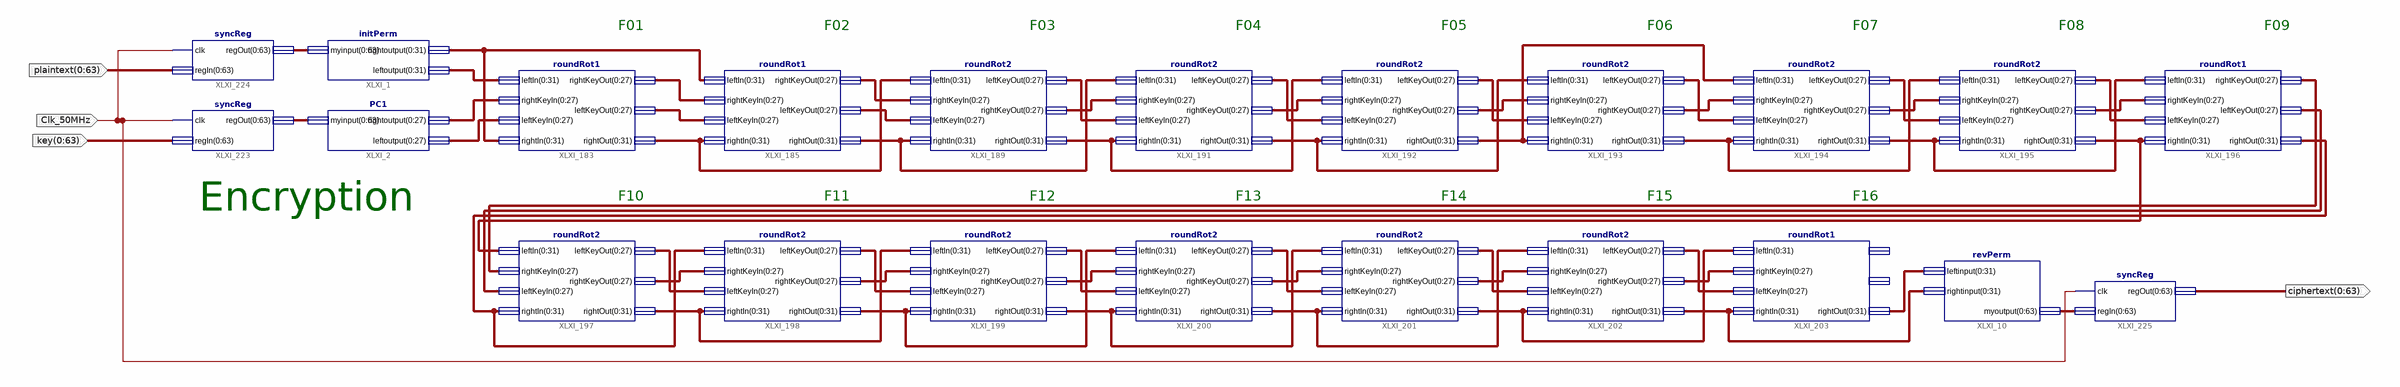
[diagram p0: schematic sheet 1]
// Xilinx ISE schematic schem.sch (spartan3e) as structural Verilog: 22 symbols, 4 ports
module schem (
  input  [0:63] key,
  input  Clk_50MHz,
  input  [0:63] plaintext,
  output [0:63] ciphertext
);

  wire [27:0] C0, D0, XLXN_493, XLXN_494, XLXN_499, XLXN_500, XLXN_502, XLXN_503, XLXN_506, XLXN_507,
       XLXN_509, XLXN_510, XLXN_512, XLXN_513, XLXN_515, XLXN_516, XLXN_518, XLXN_519, XLXN_527, XLXN_529,
       XLXN_532, XLXN_533, XLXN_536, XLXN_537, XLXN_539, XLXN_540, XLXN_542, XLXN_543, XLXN_546, XLXN_547,
       XLXN_549, XLXN_550;
  wire [31:0] XLXN_485, XLXN_496, XLXN_497, XLXN_498, XLXN_501, XLXN_505, XLXN_508, XLXN_511, XLXN_514,
       XLXN_517, XLXN_525, XLXN_531, XLXN_535, XLXN_538, XLXN_541, XLXN_545, XLXN_617, XLXN_618;
  wire [63:0] XLXN_608, XLXN_611, XLXN_616;

  PC1 XLXI_2 (
    .myinput({XLXN_608[0], XLXN_608[1], XLXN_608[2], XLXN_608[3], XLXN_608[4], XLXN_608[5], XLXN_608[6], XLXN_608[7], XLXN_608[8], XLXN_608[9], XLXN_608[10], XLXN_608[11], XLXN_608[12], XLXN_608[13], XLXN_608[14], XLXN_608[15], XLXN_608[16], XLXN_608[17], XLXN_608[18], XLXN_608[19], XLXN_608[20], XLXN_608[21], XLXN_608[22], XLXN_608[23], XLXN_608[24], XLXN_608[25], XLXN_608[26], XLXN_608[27], XLXN_608[28], XLXN_608[29], XLXN_608[30], XLXN_608[31], XLXN_608[32], XLXN_608[33], XLXN_608[34], XLXN_608[35], XLXN_608[36], XLXN_608[37], XLXN_608[38], XLXN_608[39], XLXN_608[40], XLXN_608[41], XLXN_608[42], XLXN_608[43], XLXN_608[44], XLXN_608[45], XLXN_608[46], XLXN_608[47], XLXN_608[48], XLXN_608[49], XLXN_608[50], XLXN_608[51], XLXN_608[52], XLXN_608[53], XLXN_608[54], XLXN_608[55], XLXN_608[56], XLXN_608[57], XLXN_608[58], XLXN_608[59], XLXN_608[60], XLXN_608[61], XLXN_608[62], XLXN_608[63]}),
    .rightoutput({D0[0], D0[1], D0[2], D0[3], D0[4], D0[5], D0[6], D0[7], D0[8], D0[9], D0[10], D0[11], D0[12], D0[13], D0[14], D0[15], D0[16], D0[17], D0[18], D0[19], D0[20], D0[21], D0[22], D0[23], D0[24], D0[25], D0[26], D0[27]}),
    .leftoutput({C0[0], C0[1], C0[2], C0[3], C0[4], C0[5], C0[6], C0[7], C0[8], C0[9], C0[10], C0[11], C0[12], C0[13], C0[14], C0[15], C0[16], C0[17], C0[18], C0[19], C0[20], C0[21], C0[22], C0[23], C0[24], C0[25], C0[26], C0[27]}));
  initPerm XLXI_1 (
    .myinput({XLXN_611[0], XLXN_611[1], XLXN_611[2], XLXN_611[3], XLXN_611[4], XLXN_611[5], XLXN_611[6], XLXN_611[7], XLXN_611[8], XLXN_611[9], XLXN_611[10], XLXN_611[11], XLXN_611[12], XLXN_611[13], XLXN_611[14], XLXN_611[15], XLXN_611[16], XLXN_611[17], XLXN_611[18], XLXN_611[19], XLXN_611[20], XLXN_611[21], XLXN_611[22], XLXN_611[23], XLXN_611[24], XLXN_611[25], XLXN_611[26], XLXN_611[27], XLXN_611[28], XLXN_611[29], XLXN_611[30], XLXN_611[31], XLXN_611[32], XLXN_611[33], XLXN_611[34], XLXN_611[35], XLXN_611[36], XLXN_611[37], XLXN_611[38], XLXN_611[39], XLXN_611[40], XLXN_611[41], XLXN_611[42], XLXN_611[43], XLXN_611[44], XLXN_611[45], XLXN_611[46], XLXN_611[47], XLXN_611[48], XLXN_611[49], XLXN_611[50], XLXN_611[51], XLXN_611[52], XLXN_611[53], XLXN_611[54], XLXN_611[55], XLXN_611[56], XLXN_611[57], XLXN_611[58], XLXN_611[59], XLXN_611[60], XLXN_611[61], XLXN_611[62], XLXN_611[63]}),
    .rightoutput({XLXN_496[0], XLXN_496[1], XLXN_496[2], XLXN_496[3], XLXN_496[4], XLXN_496[5], XLXN_496[6], XLXN_496[7], XLXN_496[8], XLXN_496[9], XLXN_496[10], XLXN_496[11], XLXN_496[12], XLXN_496[13], XLXN_496[14], XLXN_496[15], XLXN_496[16], XLXN_496[17], XLXN_496[18], XLXN_496[19], XLXN_496[20], XLXN_496[21], XLXN_496[22], XLXN_496[23], XLXN_496[24], XLXN_496[25], XLXN_496[26], XLXN_496[27], XLXN_496[28], XLXN_496[29], XLXN_496[30], XLXN_496[31]}),
    .leftoutput({XLXN_485[0], XLXN_485[1], XLXN_485[2], XLXN_485[3], XLXN_485[4], XLXN_485[5], XLXN_485[6], XLXN_485[7], XLXN_485[8], XLXN_485[9], XLXN_485[10], XLXN_485[11], XLXN_485[12], XLXN_485[13], XLXN_485[14], XLXN_485[15], XLXN_485[16], XLXN_485[17], XLXN_485[18], XLXN_485[19], XLXN_485[20], XLXN_485[21], XLXN_485[22], XLXN_485[23], XLXN_485[24], XLXN_485[25], XLXN_485[26], XLXN_485[27], XLXN_485[28], XLXN_485[29], XLXN_485[30], XLXN_485[31]}));
  roundRot1 XLXI_183 (
    .leftIn({XLXN_485[0], XLXN_485[1], XLXN_485[2], XLXN_485[3], XLXN_485[4], XLXN_485[5], XLXN_485[6], XLXN_485[7], XLXN_485[8], XLXN_485[9], XLXN_485[10], XLXN_485[11], XLXN_485[12], XLXN_485[13], XLXN_485[14], XLXN_485[15], XLXN_485[16], XLXN_485[17], XLXN_485[18], XLXN_485[19], XLXN_485[20], XLXN_485[21], XLXN_485[22], XLXN_485[23], XLXN_485[24], XLXN_485[25], XLXN_485[26], XLXN_485[27], XLXN_485[28], XLXN_485[29], XLXN_485[30], XLXN_485[31]}),
    .rightKeyIn({D0[0], D0[1], D0[2], D0[3], D0[4], D0[5], D0[6], D0[7], D0[8], D0[9], D0[10], D0[11], D0[12], D0[13], D0[14], D0[15], D0[16], D0[17], D0[18], D0[19], D0[20], D0[21], D0[22], D0[23], D0[24], D0[25], D0[26], D0[27]}),
    .leftKeyIn({C0[0], C0[1], C0[2], C0[3], C0[4], C0[5], C0[6], C0[7], C0[8], C0[9], C0[10], C0[11], C0[12], C0[13], C0[14], C0[15], C0[16], C0[17], C0[18], C0[19], C0[20], C0[21], C0[22], C0[23], C0[24], C0[25], C0[26], C0[27]}),
    .rightIn({XLXN_496[0], XLXN_496[1], XLXN_496[2], XLXN_496[3], XLXN_496[4], XLXN_496[5], XLXN_496[6], XLXN_496[7], XLXN_496[8], XLXN_496[9], XLXN_496[10], XLXN_496[11], XLXN_496[12], XLXN_496[13], XLXN_496[14], XLXN_496[15], XLXN_496[16], XLXN_496[17], XLXN_496[18], XLXN_496[19], XLXN_496[20], XLXN_496[21], XLXN_496[22], XLXN_496[23], XLXN_496[24], XLXN_496[25], XLXN_496[26], XLXN_496[27], XLXN_496[28], XLXN_496[29], XLXN_496[30], XLXN_496[31]}),
    .rightKeyOut({XLXN_493[0], XLXN_493[1], XLXN_493[2], XLXN_493[3], XLXN_493[4], XLXN_493[5], XLXN_493[6], XLXN_493[7], XLXN_493[8], XLXN_493[9], XLXN_493[10], XLXN_493[11], XLXN_493[12], XLXN_493[13], XLXN_493[14], XLXN_493[15], XLXN_493[16], XLXN_493[17], XLXN_493[18], XLXN_493[19], XLXN_493[20], XLXN_493[21], XLXN_493[22], XLXN_493[23], XLXN_493[24], XLXN_493[25], XLXN_493[26], XLXN_493[27]}),
    .leftKeyOut({XLXN_494[0], XLXN_494[1], XLXN_494[2], XLXN_494[3], XLXN_494[4], XLXN_494[5], XLXN_494[6], XLXN_494[7], XLXN_494[8], XLXN_494[9], XLXN_494[10], XLXN_494[11], XLXN_494[12], XLXN_494[13], XLXN_494[14], XLXN_494[15], XLXN_494[16], XLXN_494[17], XLXN_494[18], XLXN_494[19], XLXN_494[20], XLXN_494[21], XLXN_494[22], XLXN_494[23], XLXN_494[24], XLXN_494[25], XLXN_494[26], XLXN_494[27]}),
    .rightOut({XLXN_497[0], XLXN_497[1], XLXN_497[2], XLXN_497[3], XLXN_497[4], XLXN_497[5], XLXN_497[6], XLXN_497[7], XLXN_497[8], XLXN_497[9], XLXN_497[10], XLXN_497[11], XLXN_497[12], XLXN_497[13], XLXN_497[14], XLXN_497[15], XLXN_497[16], XLXN_497[17], XLXN_497[18], XLXN_497[19], XLXN_497[20], XLXN_497[21], XLXN_497[22], XLXN_497[23], XLXN_497[24], XLXN_497[25], XLXN_497[26], XLXN_497[27], XLXN_497[28], XLXN_497[29], XLXN_497[30], XLXN_497[31]}));
  roundRot1 XLXI_185 (
    .leftIn({XLXN_496[0], XLXN_496[1], XLXN_496[2], XLXN_496[3], XLXN_496[4], XLXN_496[5], XLXN_496[6], XLXN_496[7], XLXN_496[8], XLXN_496[9], XLXN_496[10], XLXN_496[11], XLXN_496[12], XLXN_496[13], XLXN_496[14], XLXN_496[15], XLXN_496[16], XLXN_496[17], XLXN_496[18], XLXN_496[19], XLXN_496[20], XLXN_496[21], XLXN_496[22], XLXN_496[23], XLXN_496[24], XLXN_496[25], XLXN_496[26], XLXN_496[27], XLXN_496[28], XLXN_496[29], XLXN_496[30], XLXN_496[31]}),
    .rightKeyIn({XLXN_493[0], XLXN_493[1], XLXN_493[2], XLXN_493[3], XLXN_493[4], XLXN_493[5], XLXN_493[6], XLXN_493[7], XLXN_493[8], XLXN_493[9], XLXN_493[10], XLXN_493[11], XLXN_493[12], XLXN_493[13], XLXN_493[14], XLXN_493[15], XLXN_493[16], XLXN_493[17], XLXN_493[18], XLXN_493[19], XLXN_493[20], XLXN_493[21], XLXN_493[22], XLXN_493[23], XLXN_493[24], XLXN_493[25], XLXN_493[26], XLXN_493[27]}),
    .leftKeyIn({XLXN_494[0], XLXN_494[1], XLXN_494[2], XLXN_494[3], XLXN_494[4], XLXN_494[5], XLXN_494[6], XLXN_494[7], XLXN_494[8], XLXN_494[9], XLXN_494[10], XLXN_494[11], XLXN_494[12], XLXN_494[13], XLXN_494[14], XLXN_494[15], XLXN_494[16], XLXN_494[17], XLXN_494[18], XLXN_494[19], XLXN_494[20], XLXN_494[21], XLXN_494[22], XLXN_494[23], XLXN_494[24], XLXN_494[25], XLXN_494[26], XLXN_494[27]}),
    .rightIn({XLXN_497[0], XLXN_497[1], XLXN_497[2], XLXN_497[3], XLXN_497[4], XLXN_497[5], XLXN_497[6], XLXN_497[7], XLXN_497[8], XLXN_497[9], XLXN_497[10], XLXN_497[11], XLXN_497[12], XLXN_497[13], XLXN_497[14], XLXN_497[15], XLXN_497[16], XLXN_497[17], XLXN_497[18], XLXN_497[19], XLXN_497[20], XLXN_497[21], XLXN_497[22], XLXN_497[23], XLXN_497[24], XLXN_497[25], XLXN_497[26], XLXN_497[27], XLXN_497[28], XLXN_497[29], XLXN_497[30], XLXN_497[31]}),
    .rightKeyOut({XLXN_500[0], XLXN_500[1], XLXN_500[2], XLXN_500[3], XLXN_500[4], XLXN_500[5], XLXN_500[6], XLXN_500[7], XLXN_500[8], XLXN_500[9], XLXN_500[10], XLXN_500[11], XLXN_500[12], XLXN_500[13], XLXN_500[14], XLXN_500[15], XLXN_500[16], XLXN_500[17], XLXN_500[18], XLXN_500[19], XLXN_500[20], XLXN_500[21], XLXN_500[22], XLXN_500[23], XLXN_500[24], XLXN_500[25], XLXN_500[26], XLXN_500[27]}),
    .leftKeyOut({XLXN_499[0], XLXN_499[1], XLXN_499[2], XLXN_499[3], XLXN_499[4], XLXN_499[5], XLXN_499[6], XLXN_499[7], XLXN_499[8], XLXN_499[9], XLXN_499[10], XLXN_499[11], XLXN_499[12], XLXN_499[13], XLXN_499[14], XLXN_499[15], XLXN_499[16], XLXN_499[17], XLXN_499[18], XLXN_499[19], XLXN_499[20], XLXN_499[21], XLXN_499[22], XLXN_499[23], XLXN_499[24], XLXN_499[25], XLXN_499[26], XLXN_499[27]}),
    .rightOut({XLXN_498[0], XLXN_498[1], XLXN_498[2], XLXN_498[3], XLXN_498[4], XLXN_498[5], XLXN_498[6], XLXN_498[7], XLXN_498[8], XLXN_498[9], XLXN_498[10], XLXN_498[11], XLXN_498[12], XLXN_498[13], XLXN_498[14], XLXN_498[15], XLXN_498[16], XLXN_498[17], XLXN_498[18], XLXN_498[19], XLXN_498[20], XLXN_498[21], XLXN_498[22], XLXN_498[23], XLXN_498[24], XLXN_498[25], XLXN_498[26], XLXN_498[27], XLXN_498[28], XLXN_498[29], XLXN_498[30], XLXN_498[31]}));
  roundRot2 XLXI_189 (
    .leftIn({XLXN_497[0], XLXN_497[1], XLXN_497[2], XLXN_497[3], XLXN_497[4], XLXN_497[5], XLXN_497[6], XLXN_497[7], XLXN_497[8], XLXN_497[9], XLXN_497[10], XLXN_497[11], XLXN_497[12], XLXN_497[13], XLXN_497[14], XLXN_497[15], XLXN_497[16], XLXN_497[17], XLXN_497[18], XLXN_497[19], XLXN_497[20], XLXN_497[21], XLXN_497[22], XLXN_497[23], XLXN_497[24], XLXN_497[25], XLXN_497[26], XLXN_497[27], XLXN_497[28], XLXN_497[29], XLXN_497[30], XLXN_497[31]}),
    .rightKeyIn({XLXN_500[0], XLXN_500[1], XLXN_500[2], XLXN_500[3], XLXN_500[4], XLXN_500[5], XLXN_500[6], XLXN_500[7], XLXN_500[8], XLXN_500[9], XLXN_500[10], XLXN_500[11], XLXN_500[12], XLXN_500[13], XLXN_500[14], XLXN_500[15], XLXN_500[16], XLXN_500[17], XLXN_500[18], XLXN_500[19], XLXN_500[20], XLXN_500[21], XLXN_500[22], XLXN_500[23], XLXN_500[24], XLXN_500[25], XLXN_500[26], XLXN_500[27]}),
    .leftKeyIn({XLXN_499[0], XLXN_499[1], XLXN_499[2], XLXN_499[3], XLXN_499[4], XLXN_499[5], XLXN_499[6], XLXN_499[7], XLXN_499[8], XLXN_499[9], XLXN_499[10], XLXN_499[11], XLXN_499[12], XLXN_499[13], XLXN_499[14], XLXN_499[15], XLXN_499[16], XLXN_499[17], XLXN_499[18], XLXN_499[19], XLXN_499[20], XLXN_499[21], XLXN_499[22], XLXN_499[23], XLXN_499[24], XLXN_499[25], XLXN_499[26], XLXN_499[27]}),
    .rightIn({XLXN_498[0], XLXN_498[1], XLXN_498[2], XLXN_498[3], XLXN_498[4], XLXN_498[5], XLXN_498[6], XLXN_498[7], XLXN_498[8], XLXN_498[9], XLXN_498[10], XLXN_498[11], XLXN_498[12], XLXN_498[13], XLXN_498[14], XLXN_498[15], XLXN_498[16], XLXN_498[17], XLXN_498[18], XLXN_498[19], XLXN_498[20], XLXN_498[21], XLXN_498[22], XLXN_498[23], XLXN_498[24], XLXN_498[25], XLXN_498[26], XLXN_498[27], XLXN_498[28], XLXN_498[29], XLXN_498[30], XLXN_498[31]}),
    .leftKeyOut({XLXN_503[0], XLXN_503[1], XLXN_503[2], XLXN_503[3], XLXN_503[4], XLXN_503[5], XLXN_503[6], XLXN_503[7], XLXN_503[8], XLXN_503[9], XLXN_503[10], XLXN_503[11], XLXN_503[12], XLXN_503[13], XLXN_503[14], XLXN_503[15], XLXN_503[16], XLXN_503[17], XLXN_503[18], XLXN_503[19], XLXN_503[20], XLXN_503[21], XLXN_503[22], XLXN_503[23], XLXN_503[24], XLXN_503[25], XLXN_503[26], XLXN_503[27]}),
    .rightKeyOut({XLXN_502[0], XLXN_502[1], XLXN_502[2], XLXN_502[3], XLXN_502[4], XLXN_502[5], XLXN_502[6], XLXN_502[7], XLXN_502[8], XLXN_502[9], XLXN_502[10], XLXN_502[11], XLXN_502[12], XLXN_502[13], XLXN_502[14], XLXN_502[15], XLXN_502[16], XLXN_502[17], XLXN_502[18], XLXN_502[19], XLXN_502[20], XLXN_502[21], XLXN_502[22], XLXN_502[23], XLXN_502[24], XLXN_502[25], XLXN_502[26], XLXN_502[27]}),
    .rightOut({XLXN_501[0], XLXN_501[1], XLXN_501[2], XLXN_501[3], XLXN_501[4], XLXN_501[5], XLXN_501[6], XLXN_501[7], XLXN_501[8], XLXN_501[9], XLXN_501[10], XLXN_501[11], XLXN_501[12], XLXN_501[13], XLXN_501[14], XLXN_501[15], XLXN_501[16], XLXN_501[17], XLXN_501[18], XLXN_501[19], XLXN_501[20], XLXN_501[21], XLXN_501[22], XLXN_501[23], XLXN_501[24], XLXN_501[25], XLXN_501[26], XLXN_501[27], XLXN_501[28], XLXN_501[29], XLXN_501[30], XLXN_501[31]}));
  roundRot2 XLXI_191 (
    .leftIn({XLXN_498[0], XLXN_498[1], XLXN_498[2], XLXN_498[3], XLXN_498[4], XLXN_498[5], XLXN_498[6], XLXN_498[7], XLXN_498[8], XLXN_498[9], XLXN_498[10], XLXN_498[11], XLXN_498[12], XLXN_498[13], XLXN_498[14], XLXN_498[15], XLXN_498[16], XLXN_498[17], XLXN_498[18], XLXN_498[19], XLXN_498[20], XLXN_498[21], XLXN_498[22], XLXN_498[23], XLXN_498[24], XLXN_498[25], XLXN_498[26], XLXN_498[27], XLXN_498[28], XLXN_498[29], XLXN_498[30], XLXN_498[31]}),
    .rightKeyIn({XLXN_502[0], XLXN_502[1], XLXN_502[2], XLXN_502[3], XLXN_502[4], XLXN_502[5], XLXN_502[6], XLXN_502[7], XLXN_502[8], XLXN_502[9], XLXN_502[10], XLXN_502[11], XLXN_502[12], XLXN_502[13], XLXN_502[14], XLXN_502[15], XLXN_502[16], XLXN_502[17], XLXN_502[18], XLXN_502[19], XLXN_502[20], XLXN_502[21], XLXN_502[22], XLXN_502[23], XLXN_502[24], XLXN_502[25], XLXN_502[26], XLXN_502[27]}),
    .leftKeyIn({XLXN_503[0], XLXN_503[1], XLXN_503[2], XLXN_503[3], XLXN_503[4], XLXN_503[5], XLXN_503[6], XLXN_503[7], XLXN_503[8], XLXN_503[9], XLXN_503[10], XLXN_503[11], XLXN_503[12], XLXN_503[13], XLXN_503[14], XLXN_503[15], XLXN_503[16], XLXN_503[17], XLXN_503[18], XLXN_503[19], XLXN_503[20], XLXN_503[21], XLXN_503[22], XLXN_503[23], XLXN_503[24], XLXN_503[25], XLXN_503[26], XLXN_503[27]}),
    .rightIn({XLXN_501[0], XLXN_501[1], XLXN_501[2], XLXN_501[3], XLXN_501[4], XLXN_501[5], XLXN_501[6], XLXN_501[7], XLXN_501[8], XLXN_501[9], XLXN_501[10], XLXN_501[11], XLXN_501[12], XLXN_501[13], XLXN_501[14], XLXN_501[15], XLXN_501[16], XLXN_501[17], XLXN_501[18], XLXN_501[19], XLXN_501[20], XLXN_501[21], XLXN_501[22], XLXN_501[23], XLXN_501[24], XLXN_501[25], XLXN_501[26], XLXN_501[27], XLXN_501[28], XLXN_501[29], XLXN_501[30], XLXN_501[31]}),
    .leftKeyOut({XLXN_507[0], XLXN_507[1], XLXN_507[2], XLXN_507[3], XLXN_507[4], XLXN_507[5], XLXN_507[6], XLXN_507[7], XLXN_507[8], XLXN_507[9], XLXN_507[10], XLXN_507[11], XLXN_507[12], XLXN_507[13], XLXN_507[14], XLXN_507[15], XLXN_507[16], XLXN_507[17], XLXN_507[18], XLXN_507[19], XLXN_507[20], XLXN_507[21], XLXN_507[22], XLXN_507[23], XLXN_507[24], XLXN_507[25], XLXN_507[26], XLXN_507[27]}),
    .rightKeyOut({XLXN_506[0], XLXN_506[1], XLXN_506[2], XLXN_506[3], XLXN_506[4], XLXN_506[5], XLXN_506[6], XLXN_506[7], XLXN_506[8], XLXN_506[9], XLXN_506[10], XLXN_506[11], XLXN_506[12], XLXN_506[13], XLXN_506[14], XLXN_506[15], XLXN_506[16], XLXN_506[17], XLXN_506[18], XLXN_506[19], XLXN_506[20], XLXN_506[21], XLXN_506[22], XLXN_506[23], XLXN_506[24], XLXN_506[25], XLXN_506[26], XLXN_506[27]}),
    .rightOut({XLXN_505[0], XLXN_505[1], XLXN_505[2], XLXN_505[3], XLXN_505[4], XLXN_505[5], XLXN_505[6], XLXN_505[7], XLXN_505[8], XLXN_505[9], XLXN_505[10], XLXN_505[11], XLXN_505[12], XLXN_505[13], XLXN_505[14], XLXN_505[15], XLXN_505[16], XLXN_505[17], XLXN_505[18], XLXN_505[19], XLXN_505[20], XLXN_505[21], XLXN_505[22], XLXN_505[23], XLXN_505[24], XLXN_505[25], XLXN_505[26], XLXN_505[27], XLXN_505[28], XLXN_505[29], XLXN_505[30], XLXN_505[31]}));
  roundRot2 XLXI_192 (
    .leftIn({XLXN_501[0], XLXN_501[1], XLXN_501[2], XLXN_501[3], XLXN_501[4], XLXN_501[5], XLXN_501[6], XLXN_501[7], XLXN_501[8], XLXN_501[9], XLXN_501[10], XLXN_501[11], XLXN_501[12], XLXN_501[13], XLXN_501[14], XLXN_501[15], XLXN_501[16], XLXN_501[17], XLXN_501[18], XLXN_501[19], XLXN_501[20], XLXN_501[21], XLXN_501[22], XLXN_501[23], XLXN_501[24], XLXN_501[25], XLXN_501[26], XLXN_501[27], XLXN_501[28], XLXN_501[29], XLXN_501[30], XLXN_501[31]}),
    .rightKeyIn({XLXN_506[0], XLXN_506[1], XLXN_506[2], XLXN_506[3], XLXN_506[4], XLXN_506[5], XLXN_506[6], XLXN_506[7], XLXN_506[8], XLXN_506[9], XLXN_506[10], XLXN_506[11], XLXN_506[12], XLXN_506[13], XLXN_506[14], XLXN_506[15], XLXN_506[16], XLXN_506[17], XLXN_506[18], XLXN_506[19], XLXN_506[20], XLXN_506[21], XLXN_506[22], XLXN_506[23], XLXN_506[24], XLXN_506[25], XLXN_506[26], XLXN_506[27]}),
    .leftKeyIn({XLXN_507[0], XLXN_507[1], XLXN_507[2], XLXN_507[3], XLXN_507[4], XLXN_507[5], XLXN_507[6], XLXN_507[7], XLXN_507[8], XLXN_507[9], XLXN_507[10], XLXN_507[11], XLXN_507[12], XLXN_507[13], XLXN_507[14], XLXN_507[15], XLXN_507[16], XLXN_507[17], XLXN_507[18], XLXN_507[19], XLXN_507[20], XLXN_507[21], XLXN_507[22], XLXN_507[23], XLXN_507[24], XLXN_507[25], XLXN_507[26], XLXN_507[27]}),
    .rightIn({XLXN_505[0], XLXN_505[1], XLXN_505[2], XLXN_505[3], XLXN_505[4], XLXN_505[5], XLXN_505[6], XLXN_505[7], XLXN_505[8], XLXN_505[9], XLXN_505[10], XLXN_505[11], XLXN_505[12], XLXN_505[13], XLXN_505[14], XLXN_505[15], XLXN_505[16], XLXN_505[17], XLXN_505[18], XLXN_505[19], XLXN_505[20], XLXN_505[21], XLXN_505[22], XLXN_505[23], XLXN_505[24], XLXN_505[25], XLXN_505[26], XLXN_505[27], XLXN_505[28], XLXN_505[29], XLXN_505[30], XLXN_505[31]}),
    .leftKeyOut({XLXN_510[0], XLXN_510[1], XLXN_510[2], XLXN_510[3], XLXN_510[4], XLXN_510[5], XLXN_510[6], XLXN_510[7], XLXN_510[8], XLXN_510[9], XLXN_510[10], XLXN_510[11], XLXN_510[12], XLXN_510[13], XLXN_510[14], XLXN_510[15], XLXN_510[16], XLXN_510[17], XLXN_510[18], XLXN_510[19], XLXN_510[20], XLXN_510[21], XLXN_510[22], XLXN_510[23], XLXN_510[24], XLXN_510[25], XLXN_510[26], XLXN_510[27]}),
    .rightKeyOut({XLXN_509[0], XLXN_509[1], XLXN_509[2], XLXN_509[3], XLXN_509[4], XLXN_509[5], XLXN_509[6], XLXN_509[7], XLXN_509[8], XLXN_509[9], XLXN_509[10], XLXN_509[11], XLXN_509[12], XLXN_509[13], XLXN_509[14], XLXN_509[15], XLXN_509[16], XLXN_509[17], XLXN_509[18], XLXN_509[19], XLXN_509[20], XLXN_509[21], XLXN_509[22], XLXN_509[23], XLXN_509[24], XLXN_509[25], XLXN_509[26], XLXN_509[27]}),
    .rightOut({XLXN_508[0], XLXN_508[1], XLXN_508[2], XLXN_508[3], XLXN_508[4], XLXN_508[5], XLXN_508[6], XLXN_508[7], XLXN_508[8], XLXN_508[9], XLXN_508[10], XLXN_508[11], XLXN_508[12], XLXN_508[13], XLXN_508[14], XLXN_508[15], XLXN_508[16], XLXN_508[17], XLXN_508[18], XLXN_508[19], XLXN_508[20], XLXN_508[21], XLXN_508[22], XLXN_508[23], XLXN_508[24], XLXN_508[25], XLXN_508[26], XLXN_508[27], XLXN_508[28], XLXN_508[29], XLXN_508[30], XLXN_508[31]}));
  roundRot2 XLXI_193 (
    .leftIn({XLXN_505[0], XLXN_505[1], XLXN_505[2], XLXN_505[3], XLXN_505[4], XLXN_505[5], XLXN_505[6], XLXN_505[7], XLXN_505[8], XLXN_505[9], XLXN_505[10], XLXN_505[11], XLXN_505[12], XLXN_505[13], XLXN_505[14], XLXN_505[15], XLXN_505[16], XLXN_505[17], XLXN_505[18], XLXN_505[19], XLXN_505[20], XLXN_505[21], XLXN_505[22], XLXN_505[23], XLXN_505[24], XLXN_505[25], XLXN_505[26], XLXN_505[27], XLXN_505[28], XLXN_505[29], XLXN_505[30], XLXN_505[31]}),
    .rightKeyIn({XLXN_509[0], XLXN_509[1], XLXN_509[2], XLXN_509[3], XLXN_509[4], XLXN_509[5], XLXN_509[6], XLXN_509[7], XLXN_509[8], XLXN_509[9], XLXN_509[10], XLXN_509[11], XLXN_509[12], XLXN_509[13], XLXN_509[14], XLXN_509[15], XLXN_509[16], XLXN_509[17], XLXN_509[18], XLXN_509[19], XLXN_509[20], XLXN_509[21], XLXN_509[22], XLXN_509[23], XLXN_509[24], XLXN_509[25], XLXN_509[26], XLXN_509[27]}),
    .leftKeyIn({XLXN_510[0], XLXN_510[1], XLXN_510[2], XLXN_510[3], XLXN_510[4], XLXN_510[5], XLXN_510[6], XLXN_510[7], XLXN_510[8], XLXN_510[9], XLXN_510[10], XLXN_510[11], XLXN_510[12], XLXN_510[13], XLXN_510[14], XLXN_510[15], XLXN_510[16], XLXN_510[17], XLXN_510[18], XLXN_510[19], XLXN_510[20], XLXN_510[21], XLXN_510[22], XLXN_510[23], XLXN_510[24], XLXN_510[25], XLXN_510[26], XLXN_510[27]}),
    .rightIn({XLXN_508[0], XLXN_508[1], XLXN_508[2], XLXN_508[3], XLXN_508[4], XLXN_508[5], XLXN_508[6], XLXN_508[7], XLXN_508[8], XLXN_508[9], XLXN_508[10], XLXN_508[11], XLXN_508[12], XLXN_508[13], XLXN_508[14], XLXN_508[15], XLXN_508[16], XLXN_508[17], XLXN_508[18], XLXN_508[19], XLXN_508[20], XLXN_508[21], XLXN_508[22], XLXN_508[23], XLXN_508[24], XLXN_508[25], XLXN_508[26], XLXN_508[27], XLXN_508[28], XLXN_508[29], XLXN_508[30], XLXN_508[31]}),
    .leftKeyOut({XLXN_513[0], XLXN_513[1], XLXN_513[2], XLXN_513[3], XLXN_513[4], XLXN_513[5], XLXN_513[6], XLXN_513[7], XLXN_513[8], XLXN_513[9], XLXN_513[10], XLXN_513[11], XLXN_513[12], XLXN_513[13], XLXN_513[14], XLXN_513[15], XLXN_513[16], XLXN_513[17], XLXN_513[18], XLXN_513[19], XLXN_513[20], XLXN_513[21], XLXN_513[22], XLXN_513[23], XLXN_513[24], XLXN_513[25], XLXN_513[26], XLXN_513[27]}),
    .rightKeyOut({XLXN_512[0], XLXN_512[1], XLXN_512[2], XLXN_512[3], XLXN_512[4], XLXN_512[5], XLXN_512[6], XLXN_512[7], XLXN_512[8], XLXN_512[9], XLXN_512[10], XLXN_512[11], XLXN_512[12], XLXN_512[13], XLXN_512[14], XLXN_512[15], XLXN_512[16], XLXN_512[17], XLXN_512[18], XLXN_512[19], XLXN_512[20], XLXN_512[21], XLXN_512[22], XLXN_512[23], XLXN_512[24], XLXN_512[25], XLXN_512[26], XLXN_512[27]}),
    .rightOut({XLXN_511[0], XLXN_511[1], XLXN_511[2], XLXN_511[3], XLXN_511[4], XLXN_511[5], XLXN_511[6], XLXN_511[7], XLXN_511[8], XLXN_511[9], XLXN_511[10], XLXN_511[11], XLXN_511[12], XLXN_511[13], XLXN_511[14], XLXN_511[15], XLXN_511[16], XLXN_511[17], XLXN_511[18], XLXN_511[19], XLXN_511[20], XLXN_511[21], XLXN_511[22], XLXN_511[23], XLXN_511[24], XLXN_511[25], XLXN_511[26], XLXN_511[27], XLXN_511[28], XLXN_511[29], XLXN_511[30], XLXN_511[31]}));
  roundRot2 XLXI_194 (
    .leftIn({XLXN_508[0], XLXN_508[1], XLXN_508[2], XLXN_508[3], XLXN_508[4], XLXN_508[5], XLXN_508[6], XLXN_508[7], XLXN_508[8], XLXN_508[9], XLXN_508[10], XLXN_508[11], XLXN_508[12], XLXN_508[13], XLXN_508[14], XLXN_508[15], XLXN_508[16], XLXN_508[17], XLXN_508[18], XLXN_508[19], XLXN_508[20], XLXN_508[21], XLXN_508[22], XLXN_508[23], XLXN_508[24], XLXN_508[25], XLXN_508[26], XLXN_508[27], XLXN_508[28], XLXN_508[29], XLXN_508[30], XLXN_508[31]}),
    .rightKeyIn({XLXN_512[0], XLXN_512[1], XLXN_512[2], XLXN_512[3], XLXN_512[4], XLXN_512[5], XLXN_512[6], XLXN_512[7], XLXN_512[8], XLXN_512[9], XLXN_512[10], XLXN_512[11], XLXN_512[12], XLXN_512[13], XLXN_512[14], XLXN_512[15], XLXN_512[16], XLXN_512[17], XLXN_512[18], XLXN_512[19], XLXN_512[20], XLXN_512[21], XLXN_512[22], XLXN_512[23], XLXN_512[24], XLXN_512[25], XLXN_512[26], XLXN_512[27]}),
    .leftKeyIn({XLXN_513[0], XLXN_513[1], XLXN_513[2], XLXN_513[3], XLXN_513[4], XLXN_513[5], XLXN_513[6], XLXN_513[7], XLXN_513[8], XLXN_513[9], XLXN_513[10], XLXN_513[11], XLXN_513[12], XLXN_513[13], XLXN_513[14], XLXN_513[15], XLXN_513[16], XLXN_513[17], XLXN_513[18], XLXN_513[19], XLXN_513[20], XLXN_513[21], XLXN_513[22], XLXN_513[23], XLXN_513[24], XLXN_513[25], XLXN_513[26], XLXN_513[27]}),
    .rightIn({XLXN_511[0], XLXN_511[1], XLXN_511[2], XLXN_511[3], XLXN_511[4], XLXN_511[5], XLXN_511[6], XLXN_511[7], XLXN_511[8], XLXN_511[9], XLXN_511[10], XLXN_511[11], XLXN_511[12], XLXN_511[13], XLXN_511[14], XLXN_511[15], XLXN_511[16], XLXN_511[17], XLXN_511[18], XLXN_511[19], XLXN_511[20], XLXN_511[21], XLXN_511[22], XLXN_511[23], XLXN_511[24], XLXN_511[25], XLXN_511[26], XLXN_511[27], XLXN_511[28], XLXN_511[29], XLXN_511[30], XLXN_511[31]}),
    .leftKeyOut({XLXN_516[0], XLXN_516[1], XLXN_516[2], XLXN_516[3], XLXN_516[4], XLXN_516[5], XLXN_516[6], XLXN_516[7], XLXN_516[8], XLXN_516[9], XLXN_516[10], XLXN_516[11], XLXN_516[12], XLXN_516[13], XLXN_516[14], XLXN_516[15], XLXN_516[16], XLXN_516[17], XLXN_516[18], XLXN_516[19], XLXN_516[20], XLXN_516[21], XLXN_516[22], XLXN_516[23], XLXN_516[24], XLXN_516[25], XLXN_516[26], XLXN_516[27]}),
    .rightKeyOut({XLXN_515[0], XLXN_515[1], XLXN_515[2], XLXN_515[3], XLXN_515[4], XLXN_515[5], XLXN_515[6], XLXN_515[7], XLXN_515[8], XLXN_515[9], XLXN_515[10], XLXN_515[11], XLXN_515[12], XLXN_515[13], XLXN_515[14], XLXN_515[15], XLXN_515[16], XLXN_515[17], XLXN_515[18], XLXN_515[19], XLXN_515[20], XLXN_515[21], XLXN_515[22], XLXN_515[23], XLXN_515[24], XLXN_515[25], XLXN_515[26], XLXN_515[27]}),
    .rightOut({XLXN_514[0], XLXN_514[1], XLXN_514[2], XLXN_514[3], XLXN_514[4], XLXN_514[5], XLXN_514[6], XLXN_514[7], XLXN_514[8], XLXN_514[9], XLXN_514[10], XLXN_514[11], XLXN_514[12], XLXN_514[13], XLXN_514[14], XLXN_514[15], XLXN_514[16], XLXN_514[17], XLXN_514[18], XLXN_514[19], XLXN_514[20], XLXN_514[21], XLXN_514[22], XLXN_514[23], XLXN_514[24], XLXN_514[25], XLXN_514[26], XLXN_514[27], XLXN_514[28], XLXN_514[29], XLXN_514[30], XLXN_514[31]}));
  roundRot2 XLXI_195 (
    .leftIn({XLXN_511[0], XLXN_511[1], XLXN_511[2], XLXN_511[3], XLXN_511[4], XLXN_511[5], XLXN_511[6], XLXN_511[7], XLXN_511[8], XLXN_511[9], XLXN_511[10], XLXN_511[11], XLXN_511[12], XLXN_511[13], XLXN_511[14], XLXN_511[15], XLXN_511[16], XLXN_511[17], XLXN_511[18], XLXN_511[19], XLXN_511[20], XLXN_511[21], XLXN_511[22], XLXN_511[23], XLXN_511[24], XLXN_511[25], XLXN_511[26], XLXN_511[27], XLXN_511[28], XLXN_511[29], XLXN_511[30], XLXN_511[31]}),
    .rightKeyIn({XLXN_515[0], XLXN_515[1], XLXN_515[2], XLXN_515[3], XLXN_515[4], XLXN_515[5], XLXN_515[6], XLXN_515[7], XLXN_515[8], XLXN_515[9], XLXN_515[10], XLXN_515[11], XLXN_515[12], XLXN_515[13], XLXN_515[14], XLXN_515[15], XLXN_515[16], XLXN_515[17], XLXN_515[18], XLXN_515[19], XLXN_515[20], XLXN_515[21], XLXN_515[22], XLXN_515[23], XLXN_515[24], XLXN_515[25], XLXN_515[26], XLXN_515[27]}),
    .leftKeyIn({XLXN_516[0], XLXN_516[1], XLXN_516[2], XLXN_516[3], XLXN_516[4], XLXN_516[5], XLXN_516[6], XLXN_516[7], XLXN_516[8], XLXN_516[9], XLXN_516[10], XLXN_516[11], XLXN_516[12], XLXN_516[13], XLXN_516[14], XLXN_516[15], XLXN_516[16], XLXN_516[17], XLXN_516[18], XLXN_516[19], XLXN_516[20], XLXN_516[21], XLXN_516[22], XLXN_516[23], XLXN_516[24], XLXN_516[25], XLXN_516[26], XLXN_516[27]}),
    .rightIn({XLXN_514[0], XLXN_514[1], XLXN_514[2], XLXN_514[3], XLXN_514[4], XLXN_514[5], XLXN_514[6], XLXN_514[7], XLXN_514[8], XLXN_514[9], XLXN_514[10], XLXN_514[11], XLXN_514[12], XLXN_514[13], XLXN_514[14], XLXN_514[15], XLXN_514[16], XLXN_514[17], XLXN_514[18], XLXN_514[19], XLXN_514[20], XLXN_514[21], XLXN_514[22], XLXN_514[23], XLXN_514[24], XLXN_514[25], XLXN_514[26], XLXN_514[27], XLXN_514[28], XLXN_514[29], XLXN_514[30], XLXN_514[31]}),
    .leftKeyOut({XLXN_519[0], XLXN_519[1], XLXN_519[2], XLXN_519[3], XLXN_519[4], XLXN_519[5], XLXN_519[6], XLXN_519[7], XLXN_519[8], XLXN_519[9], XLXN_519[10], XLXN_519[11], XLXN_519[12], XLXN_519[13], XLXN_519[14], XLXN_519[15], XLXN_519[16], XLXN_519[17], XLXN_519[18], XLXN_519[19], XLXN_519[20], XLXN_519[21], XLXN_519[22], XLXN_519[23], XLXN_519[24], XLXN_519[25], XLXN_519[26], XLXN_519[27]}),
    .rightKeyOut({XLXN_518[0], XLXN_518[1], XLXN_518[2], XLXN_518[3], XLXN_518[4], XLXN_518[5], XLXN_518[6], XLXN_518[7], XLXN_518[8], XLXN_518[9], XLXN_518[10], XLXN_518[11], XLXN_518[12], XLXN_518[13], XLXN_518[14], XLXN_518[15], XLXN_518[16], XLXN_518[17], XLXN_518[18], XLXN_518[19], XLXN_518[20], XLXN_518[21], XLXN_518[22], XLXN_518[23], XLXN_518[24], XLXN_518[25], XLXN_518[26], XLXN_518[27]}),
    .rightOut({XLXN_517[0], XLXN_517[1], XLXN_517[2], XLXN_517[3], XLXN_517[4], XLXN_517[5], XLXN_517[6], XLXN_517[7], XLXN_517[8], XLXN_517[9], XLXN_517[10], XLXN_517[11], XLXN_517[12], XLXN_517[13], XLXN_517[14], XLXN_517[15], XLXN_517[16], XLXN_517[17], XLXN_517[18], XLXN_517[19], XLXN_517[20], XLXN_517[21], XLXN_517[22], XLXN_517[23], XLXN_517[24], XLXN_517[25], XLXN_517[26], XLXN_517[27], XLXN_517[28], XLXN_517[29], XLXN_517[30], XLXN_517[31]}));
  roundRot1 XLXI_196 (
    .leftIn({XLXN_514[0], XLXN_514[1], XLXN_514[2], XLXN_514[3], XLXN_514[4], XLXN_514[5], XLXN_514[6], XLXN_514[7], XLXN_514[8], XLXN_514[9], XLXN_514[10], XLXN_514[11], XLXN_514[12], XLXN_514[13], XLXN_514[14], XLXN_514[15], XLXN_514[16], XLXN_514[17], XLXN_514[18], XLXN_514[19], XLXN_514[20], XLXN_514[21], XLXN_514[22], XLXN_514[23], XLXN_514[24], XLXN_514[25], XLXN_514[26], XLXN_514[27], XLXN_514[28], XLXN_514[29], XLXN_514[30], XLXN_514[31]}),
    .rightKeyIn({XLXN_518[0], XLXN_518[1], XLXN_518[2], XLXN_518[3], XLXN_518[4], XLXN_518[5], XLXN_518[6], XLXN_518[7], XLXN_518[8], XLXN_518[9], XLXN_518[10], XLXN_518[11], XLXN_518[12], XLXN_518[13], XLXN_518[14], XLXN_518[15], XLXN_518[16], XLXN_518[17], XLXN_518[18], XLXN_518[19], XLXN_518[20], XLXN_518[21], XLXN_518[22], XLXN_518[23], XLXN_518[24], XLXN_518[25], XLXN_518[26], XLXN_518[27]}),
    .leftKeyIn({XLXN_519[0], XLXN_519[1], XLXN_519[2], XLXN_519[3], XLXN_519[4], XLXN_519[5], XLXN_519[6], XLXN_519[7], XLXN_519[8], XLXN_519[9], XLXN_519[10], XLXN_519[11], XLXN_519[12], XLXN_519[13], XLXN_519[14], XLXN_519[15], XLXN_519[16], XLXN_519[17], XLXN_519[18], XLXN_519[19], XLXN_519[20], XLXN_519[21], XLXN_519[22], XLXN_519[23], XLXN_519[24], XLXN_519[25], XLXN_519[26], XLXN_519[27]}),
    .rightIn({XLXN_517[0], XLXN_517[1], XLXN_517[2], XLXN_517[3], XLXN_517[4], XLXN_517[5], XLXN_517[6], XLXN_517[7], XLXN_517[8], XLXN_517[9], XLXN_517[10], XLXN_517[11], XLXN_517[12], XLXN_517[13], XLXN_517[14], XLXN_517[15], XLXN_517[16], XLXN_517[17], XLXN_517[18], XLXN_517[19], XLXN_517[20], XLXN_517[21], XLXN_517[22], XLXN_517[23], XLXN_517[24], XLXN_517[25], XLXN_517[26], XLXN_517[27], XLXN_517[28], XLXN_517[29], XLXN_517[30], XLXN_517[31]}),
    .rightKeyOut({XLXN_529[0], XLXN_529[1], XLXN_529[2], XLXN_529[3], XLXN_529[4], XLXN_529[5], XLXN_529[6], XLXN_529[7], XLXN_529[8], XLXN_529[9], XLXN_529[10], XLXN_529[11], XLXN_529[12], XLXN_529[13], XLXN_529[14], XLXN_529[15], XLXN_529[16], XLXN_529[17], XLXN_529[18], XLXN_529[19], XLXN_529[20], XLXN_529[21], XLXN_529[22], XLXN_529[23], XLXN_529[24], XLXN_529[25], XLXN_529[26], XLXN_529[27]}),
    .leftKeyOut({XLXN_527[0], XLXN_527[1], XLXN_527[2], XLXN_527[3], XLXN_527[4], XLXN_527[5], XLXN_527[6], XLXN_527[7], XLXN_527[8], XLXN_527[9], XLXN_527[10], XLXN_527[11], XLXN_527[12], XLXN_527[13], XLXN_527[14], XLXN_527[15], XLXN_527[16], XLXN_527[17], XLXN_527[18], XLXN_527[19], XLXN_527[20], XLXN_527[21], XLXN_527[22], XLXN_527[23], XLXN_527[24], XLXN_527[25], XLXN_527[26], XLXN_527[27]}),
    .rightOut({XLXN_525[0], XLXN_525[1], XLXN_525[2], XLXN_525[3], XLXN_525[4], XLXN_525[5], XLXN_525[6], XLXN_525[7], XLXN_525[8], XLXN_525[9], XLXN_525[10], XLXN_525[11], XLXN_525[12], XLXN_525[13], XLXN_525[14], XLXN_525[15], XLXN_525[16], XLXN_525[17], XLXN_525[18], XLXN_525[19], XLXN_525[20], XLXN_525[21], XLXN_525[22], XLXN_525[23], XLXN_525[24], XLXN_525[25], XLXN_525[26], XLXN_525[27], XLXN_525[28], XLXN_525[29], XLXN_525[30], XLXN_525[31]}));
  roundRot2 XLXI_197 (
    .leftIn({XLXN_517[0], XLXN_517[1], XLXN_517[2], XLXN_517[3], XLXN_517[4], XLXN_517[5], XLXN_517[6], XLXN_517[7], XLXN_517[8], XLXN_517[9], XLXN_517[10], XLXN_517[11], XLXN_517[12], XLXN_517[13], XLXN_517[14], XLXN_517[15], XLXN_517[16], XLXN_517[17], XLXN_517[18], XLXN_517[19], XLXN_517[20], XLXN_517[21], XLXN_517[22], XLXN_517[23], XLXN_517[24], XLXN_517[25], XLXN_517[26], XLXN_517[27], XLXN_517[28], XLXN_517[29], XLXN_517[30], XLXN_517[31]}),
    .rightKeyIn({XLXN_529[0], XLXN_529[1], XLXN_529[2], XLXN_529[3], XLXN_529[4], XLXN_529[5], XLXN_529[6], XLXN_529[7], XLXN_529[8], XLXN_529[9], XLXN_529[10], XLXN_529[11], XLXN_529[12], XLXN_529[13], XLXN_529[14], XLXN_529[15], XLXN_529[16], XLXN_529[17], XLXN_529[18], XLXN_529[19], XLXN_529[20], XLXN_529[21], XLXN_529[22], XLXN_529[23], XLXN_529[24], XLXN_529[25], XLXN_529[26], XLXN_529[27]}),
    .leftKeyIn({XLXN_527[0], XLXN_527[1], XLXN_527[2], XLXN_527[3], XLXN_527[4], XLXN_527[5], XLXN_527[6], XLXN_527[7], XLXN_527[8], XLXN_527[9], XLXN_527[10], XLXN_527[11], XLXN_527[12], XLXN_527[13], XLXN_527[14], XLXN_527[15], XLXN_527[16], XLXN_527[17], XLXN_527[18], XLXN_527[19], XLXN_527[20], XLXN_527[21], XLXN_527[22], XLXN_527[23], XLXN_527[24], XLXN_527[25], XLXN_527[26], XLXN_527[27]}),
    .rightIn({XLXN_525[0], XLXN_525[1], XLXN_525[2], XLXN_525[3], XLXN_525[4], XLXN_525[5], XLXN_525[6], XLXN_525[7], XLXN_525[8], XLXN_525[9], XLXN_525[10], XLXN_525[11], XLXN_525[12], XLXN_525[13], XLXN_525[14], XLXN_525[15], XLXN_525[16], XLXN_525[17], XLXN_525[18], XLXN_525[19], XLXN_525[20], XLXN_525[21], XLXN_525[22], XLXN_525[23], XLXN_525[24], XLXN_525[25], XLXN_525[26], XLXN_525[27], XLXN_525[28], XLXN_525[29], XLXN_525[30], XLXN_525[31]}),
    .leftKeyOut({XLXN_533[0], XLXN_533[1], XLXN_533[2], XLXN_533[3], XLXN_533[4], XLXN_533[5], XLXN_533[6], XLXN_533[7], XLXN_533[8], XLXN_533[9], XLXN_533[10], XLXN_533[11], XLXN_533[12], XLXN_533[13], XLXN_533[14], XLXN_533[15], XLXN_533[16], XLXN_533[17], XLXN_533[18], XLXN_533[19], XLXN_533[20], XLXN_533[21], XLXN_533[22], XLXN_533[23], XLXN_533[24], XLXN_533[25], XLXN_533[26], XLXN_533[27]}),
    .rightKeyOut({XLXN_532[0], XLXN_532[1], XLXN_532[2], XLXN_532[3], XLXN_532[4], XLXN_532[5], XLXN_532[6], XLXN_532[7], XLXN_532[8], XLXN_532[9], XLXN_532[10], XLXN_532[11], XLXN_532[12], XLXN_532[13], XLXN_532[14], XLXN_532[15], XLXN_532[16], XLXN_532[17], XLXN_532[18], XLXN_532[19], XLXN_532[20], XLXN_532[21], XLXN_532[22], XLXN_532[23], XLXN_532[24], XLXN_532[25], XLXN_532[26], XLXN_532[27]}),
    .rightOut({XLXN_531[0], XLXN_531[1], XLXN_531[2], XLXN_531[3], XLXN_531[4], XLXN_531[5], XLXN_531[6], XLXN_531[7], XLXN_531[8], XLXN_531[9], XLXN_531[10], XLXN_531[11], XLXN_531[12], XLXN_531[13], XLXN_531[14], XLXN_531[15], XLXN_531[16], XLXN_531[17], XLXN_531[18], XLXN_531[19], XLXN_531[20], XLXN_531[21], XLXN_531[22], XLXN_531[23], XLXN_531[24], XLXN_531[25], XLXN_531[26], XLXN_531[27], XLXN_531[28], XLXN_531[29], XLXN_531[30], XLXN_531[31]}));
  roundRot2 XLXI_198 (
    .leftIn({XLXN_525[0], XLXN_525[1], XLXN_525[2], XLXN_525[3], XLXN_525[4], XLXN_525[5], XLXN_525[6], XLXN_525[7], XLXN_525[8], XLXN_525[9], XLXN_525[10], XLXN_525[11], XLXN_525[12], XLXN_525[13], XLXN_525[14], XLXN_525[15], XLXN_525[16], XLXN_525[17], XLXN_525[18], XLXN_525[19], XLXN_525[20], XLXN_525[21], XLXN_525[22], XLXN_525[23], XLXN_525[24], XLXN_525[25], XLXN_525[26], XLXN_525[27], XLXN_525[28], XLXN_525[29], XLXN_525[30], XLXN_525[31]}),
    .rightKeyIn({XLXN_532[0], XLXN_532[1], XLXN_532[2], XLXN_532[3], XLXN_532[4], XLXN_532[5], XLXN_532[6], XLXN_532[7], XLXN_532[8], XLXN_532[9], XLXN_532[10], XLXN_532[11], XLXN_532[12], XLXN_532[13], XLXN_532[14], XLXN_532[15], XLXN_532[16], XLXN_532[17], XLXN_532[18], XLXN_532[19], XLXN_532[20], XLXN_532[21], XLXN_532[22], XLXN_532[23], XLXN_532[24], XLXN_532[25], XLXN_532[26], XLXN_532[27]}),
    .leftKeyIn({XLXN_533[0], XLXN_533[1], XLXN_533[2], XLXN_533[3], XLXN_533[4], XLXN_533[5], XLXN_533[6], XLXN_533[7], XLXN_533[8], XLXN_533[9], XLXN_533[10], XLXN_533[11], XLXN_533[12], XLXN_533[13], XLXN_533[14], XLXN_533[15], XLXN_533[16], XLXN_533[17], XLXN_533[18], XLXN_533[19], XLXN_533[20], XLXN_533[21], XLXN_533[22], XLXN_533[23], XLXN_533[24], XLXN_533[25], XLXN_533[26], XLXN_533[27]}),
    .rightIn({XLXN_531[0], XLXN_531[1], XLXN_531[2], XLXN_531[3], XLXN_531[4], XLXN_531[5], XLXN_531[6], XLXN_531[7], XLXN_531[8], XLXN_531[9], XLXN_531[10], XLXN_531[11], XLXN_531[12], XLXN_531[13], XLXN_531[14], XLXN_531[15], XLXN_531[16], XLXN_531[17], XLXN_531[18], XLXN_531[19], XLXN_531[20], XLXN_531[21], XLXN_531[22], XLXN_531[23], XLXN_531[24], XLXN_531[25], XLXN_531[26], XLXN_531[27], XLXN_531[28], XLXN_531[29], XLXN_531[30], XLXN_531[31]}),
    .leftKeyOut({XLXN_537[0], XLXN_537[1], XLXN_537[2], XLXN_537[3], XLXN_537[4], XLXN_537[5], XLXN_537[6], XLXN_537[7], XLXN_537[8], XLXN_537[9], XLXN_537[10], XLXN_537[11], XLXN_537[12], XLXN_537[13], XLXN_537[14], XLXN_537[15], XLXN_537[16], XLXN_537[17], XLXN_537[18], XLXN_537[19], XLXN_537[20], XLXN_537[21], XLXN_537[22], XLXN_537[23], XLXN_537[24], XLXN_537[25], XLXN_537[26], XLXN_537[27]}),
    .rightKeyOut({XLXN_536[0], XLXN_536[1], XLXN_536[2], XLXN_536[3], XLXN_536[4], XLXN_536[5], XLXN_536[6], XLXN_536[7], XLXN_536[8], XLXN_536[9], XLXN_536[10], XLXN_536[11], XLXN_536[12], XLXN_536[13], XLXN_536[14], XLXN_536[15], XLXN_536[16], XLXN_536[17], XLXN_536[18], XLXN_536[19], XLXN_536[20], XLXN_536[21], XLXN_536[22], XLXN_536[23], XLXN_536[24], XLXN_536[25], XLXN_536[26], XLXN_536[27]}),
    .rightOut({XLXN_535[0], XLXN_535[1], XLXN_535[2], XLXN_535[3], XLXN_535[4], XLXN_535[5], XLXN_535[6], XLXN_535[7], XLXN_535[8], XLXN_535[9], XLXN_535[10], XLXN_535[11], XLXN_535[12], XLXN_535[13], XLXN_535[14], XLXN_535[15], XLXN_535[16], XLXN_535[17], XLXN_535[18], XLXN_535[19], XLXN_535[20], XLXN_535[21], XLXN_535[22], XLXN_535[23], XLXN_535[24], XLXN_535[25], XLXN_535[26], XLXN_535[27], XLXN_535[28], XLXN_535[29], XLXN_535[30], XLXN_535[31]}));
  roundRot2 XLXI_200 (
    .leftIn({XLXN_535[0], XLXN_535[1], XLXN_535[2], XLXN_535[3], XLXN_535[4], XLXN_535[5], XLXN_535[6], XLXN_535[7], XLXN_535[8], XLXN_535[9], XLXN_535[10], XLXN_535[11], XLXN_535[12], XLXN_535[13], XLXN_535[14], XLXN_535[15], XLXN_535[16], XLXN_535[17], XLXN_535[18], XLXN_535[19], XLXN_535[20], XLXN_535[21], XLXN_535[22], XLXN_535[23], XLXN_535[24], XLXN_535[25], XLXN_535[26], XLXN_535[27], XLXN_535[28], XLXN_535[29], XLXN_535[30], XLXN_535[31]}),
    .rightKeyIn({XLXN_539[0], XLXN_539[1], XLXN_539[2], XLXN_539[3], XLXN_539[4], XLXN_539[5], XLXN_539[6], XLXN_539[7], XLXN_539[8], XLXN_539[9], XLXN_539[10], XLXN_539[11], XLXN_539[12], XLXN_539[13], XLXN_539[14], XLXN_539[15], XLXN_539[16], XLXN_539[17], XLXN_539[18], XLXN_539[19], XLXN_539[20], XLXN_539[21], XLXN_539[22], XLXN_539[23], XLXN_539[24], XLXN_539[25], XLXN_539[26], XLXN_539[27]}),
    .leftKeyIn({XLXN_540[0], XLXN_540[1], XLXN_540[2], XLXN_540[3], XLXN_540[4], XLXN_540[5], XLXN_540[6], XLXN_540[7], XLXN_540[8], XLXN_540[9], XLXN_540[10], XLXN_540[11], XLXN_540[12], XLXN_540[13], XLXN_540[14], XLXN_540[15], XLXN_540[16], XLXN_540[17], XLXN_540[18], XLXN_540[19], XLXN_540[20], XLXN_540[21], XLXN_540[22], XLXN_540[23], XLXN_540[24], XLXN_540[25], XLXN_540[26], XLXN_540[27]}),
    .rightIn({XLXN_538[0], XLXN_538[1], XLXN_538[2], XLXN_538[3], XLXN_538[4], XLXN_538[5], XLXN_538[6], XLXN_538[7], XLXN_538[8], XLXN_538[9], XLXN_538[10], XLXN_538[11], XLXN_538[12], XLXN_538[13], XLXN_538[14], XLXN_538[15], XLXN_538[16], XLXN_538[17], XLXN_538[18], XLXN_538[19], XLXN_538[20], XLXN_538[21], XLXN_538[22], XLXN_538[23], XLXN_538[24], XLXN_538[25], XLXN_538[26], XLXN_538[27], XLXN_538[28], XLXN_538[29], XLXN_538[30], XLXN_538[31]}),
    .leftKeyOut({XLXN_543[0], XLXN_543[1], XLXN_543[2], XLXN_543[3], XLXN_543[4], XLXN_543[5], XLXN_543[6], XLXN_543[7], XLXN_543[8], XLXN_543[9], XLXN_543[10], XLXN_543[11], XLXN_543[12], XLXN_543[13], XLXN_543[14], XLXN_543[15], XLXN_543[16], XLXN_543[17], XLXN_543[18], XLXN_543[19], XLXN_543[20], XLXN_543[21], XLXN_543[22], XLXN_543[23], XLXN_543[24], XLXN_543[25], XLXN_543[26], XLXN_543[27]}),
    .rightKeyOut({XLXN_542[0], XLXN_542[1], XLXN_542[2], XLXN_542[3], XLXN_542[4], XLXN_542[5], XLXN_542[6], XLXN_542[7], XLXN_542[8], XLXN_542[9], XLXN_542[10], XLXN_542[11], XLXN_542[12], XLXN_542[13], XLXN_542[14], XLXN_542[15], XLXN_542[16], XLXN_542[17], XLXN_542[18], XLXN_542[19], XLXN_542[20], XLXN_542[21], XLXN_542[22], XLXN_542[23], XLXN_542[24], XLXN_542[25], XLXN_542[26], XLXN_542[27]}),
    .rightOut({XLXN_541[0], XLXN_541[1], XLXN_541[2], XLXN_541[3], XLXN_541[4], XLXN_541[5], XLXN_541[6], XLXN_541[7], XLXN_541[8], XLXN_541[9], XLXN_541[10], XLXN_541[11], XLXN_541[12], XLXN_541[13], XLXN_541[14], XLXN_541[15], XLXN_541[16], XLXN_541[17], XLXN_541[18], XLXN_541[19], XLXN_541[20], XLXN_541[21], XLXN_541[22], XLXN_541[23], XLXN_541[24], XLXN_541[25], XLXN_541[26], XLXN_541[27], XLXN_541[28], XLXN_541[29], XLXN_541[30], XLXN_541[31]}));
  roundRot2 XLXI_201 (
    .leftIn({XLXN_538[0], XLXN_538[1], XLXN_538[2], XLXN_538[3], XLXN_538[4], XLXN_538[5], XLXN_538[6], XLXN_538[7], XLXN_538[8], XLXN_538[9], XLXN_538[10], XLXN_538[11], XLXN_538[12], XLXN_538[13], XLXN_538[14], XLXN_538[15], XLXN_538[16], XLXN_538[17], XLXN_538[18], XLXN_538[19], XLXN_538[20], XLXN_538[21], XLXN_538[22], XLXN_538[23], XLXN_538[24], XLXN_538[25], XLXN_538[26], XLXN_538[27], XLXN_538[28], XLXN_538[29], XLXN_538[30], XLXN_538[31]}),
    .rightKeyIn({XLXN_542[0], XLXN_542[1], XLXN_542[2], XLXN_542[3], XLXN_542[4], XLXN_542[5], XLXN_542[6], XLXN_542[7], XLXN_542[8], XLXN_542[9], XLXN_542[10], XLXN_542[11], XLXN_542[12], XLXN_542[13], XLXN_542[14], XLXN_542[15], XLXN_542[16], XLXN_542[17], XLXN_542[18], XLXN_542[19], XLXN_542[20], XLXN_542[21], XLXN_542[22], XLXN_542[23], XLXN_542[24], XLXN_542[25], XLXN_542[26], XLXN_542[27]}),
    .leftKeyIn({XLXN_543[0], XLXN_543[1], XLXN_543[2], XLXN_543[3], XLXN_543[4], XLXN_543[5], XLXN_543[6], XLXN_543[7], XLXN_543[8], XLXN_543[9], XLXN_543[10], XLXN_543[11], XLXN_543[12], XLXN_543[13], XLXN_543[14], XLXN_543[15], XLXN_543[16], XLXN_543[17], XLXN_543[18], XLXN_543[19], XLXN_543[20], XLXN_543[21], XLXN_543[22], XLXN_543[23], XLXN_543[24], XLXN_543[25], XLXN_543[26], XLXN_543[27]}),
    .rightIn({XLXN_541[0], XLXN_541[1], XLXN_541[2], XLXN_541[3], XLXN_541[4], XLXN_541[5], XLXN_541[6], XLXN_541[7], XLXN_541[8], XLXN_541[9], XLXN_541[10], XLXN_541[11], XLXN_541[12], XLXN_541[13], XLXN_541[14], XLXN_541[15], XLXN_541[16], XLXN_541[17], XLXN_541[18], XLXN_541[19], XLXN_541[20], XLXN_541[21], XLXN_541[22], XLXN_541[23], XLXN_541[24], XLXN_541[25], XLXN_541[26], XLXN_541[27], XLXN_541[28], XLXN_541[29], XLXN_541[30], XLXN_541[31]}),
    .leftKeyOut({XLXN_547[0], XLXN_547[1], XLXN_547[2], XLXN_547[3], XLXN_547[4], XLXN_547[5], XLXN_547[6], XLXN_547[7], XLXN_547[8], XLXN_547[9], XLXN_547[10], XLXN_547[11], XLXN_547[12], XLXN_547[13], XLXN_547[14], XLXN_547[15], XLXN_547[16], XLXN_547[17], XLXN_547[18], XLXN_547[19], XLXN_547[20], XLXN_547[21], XLXN_547[22], XLXN_547[23], XLXN_547[24], XLXN_547[25], XLXN_547[26], XLXN_547[27]}),
    .rightKeyOut({XLXN_546[0], XLXN_546[1], XLXN_546[2], XLXN_546[3], XLXN_546[4], XLXN_546[5], XLXN_546[6], XLXN_546[7], XLXN_546[8], XLXN_546[9], XLXN_546[10], XLXN_546[11], XLXN_546[12], XLXN_546[13], XLXN_546[14], XLXN_546[15], XLXN_546[16], XLXN_546[17], XLXN_546[18], XLXN_546[19], XLXN_546[20], XLXN_546[21], XLXN_546[22], XLXN_546[23], XLXN_546[24], XLXN_546[25], XLXN_546[26], XLXN_546[27]}),
    .rightOut({XLXN_545[0], XLXN_545[1], XLXN_545[2], XLXN_545[3], XLXN_545[4], XLXN_545[5], XLXN_545[6], XLXN_545[7], XLXN_545[8], XLXN_545[9], XLXN_545[10], XLXN_545[11], XLXN_545[12], XLXN_545[13], XLXN_545[14], XLXN_545[15], XLXN_545[16], XLXN_545[17], XLXN_545[18], XLXN_545[19], XLXN_545[20], XLXN_545[21], XLXN_545[22], XLXN_545[23], XLXN_545[24], XLXN_545[25], XLXN_545[26], XLXN_545[27], XLXN_545[28], XLXN_545[29], XLXN_545[30], XLXN_545[31]}));
  roundRot2 XLXI_202 (
    .leftIn({XLXN_541[0], XLXN_541[1], XLXN_541[2], XLXN_541[3], XLXN_541[4], XLXN_541[5], XLXN_541[6], XLXN_541[7], XLXN_541[8], XLXN_541[9], XLXN_541[10], XLXN_541[11], XLXN_541[12], XLXN_541[13], XLXN_541[14], XLXN_541[15], XLXN_541[16], XLXN_541[17], XLXN_541[18], XLXN_541[19], XLXN_541[20], XLXN_541[21], XLXN_541[22], XLXN_541[23], XLXN_541[24], XLXN_541[25], XLXN_541[26], XLXN_541[27], XLXN_541[28], XLXN_541[29], XLXN_541[30], XLXN_541[31]}),
    .rightKeyIn({XLXN_546[0], XLXN_546[1], XLXN_546[2], XLXN_546[3], XLXN_546[4], XLXN_546[5], XLXN_546[6], XLXN_546[7], XLXN_546[8], XLXN_546[9], XLXN_546[10], XLXN_546[11], XLXN_546[12], XLXN_546[13], XLXN_546[14], XLXN_546[15], XLXN_546[16], XLXN_546[17], XLXN_546[18], XLXN_546[19], XLXN_546[20], XLXN_546[21], XLXN_546[22], XLXN_546[23], XLXN_546[24], XLXN_546[25], XLXN_546[26], XLXN_546[27]}),
    .leftKeyIn({XLXN_547[0], XLXN_547[1], XLXN_547[2], XLXN_547[3], XLXN_547[4], XLXN_547[5], XLXN_547[6], XLXN_547[7], XLXN_547[8], XLXN_547[9], XLXN_547[10], XLXN_547[11], XLXN_547[12], XLXN_547[13], XLXN_547[14], XLXN_547[15], XLXN_547[16], XLXN_547[17], XLXN_547[18], XLXN_547[19], XLXN_547[20], XLXN_547[21], XLXN_547[22], XLXN_547[23], XLXN_547[24], XLXN_547[25], XLXN_547[26], XLXN_547[27]}),
    .rightIn({XLXN_545[0], XLXN_545[1], XLXN_545[2], XLXN_545[3], XLXN_545[4], XLXN_545[5], XLXN_545[6], XLXN_545[7], XLXN_545[8], XLXN_545[9], XLXN_545[10], XLXN_545[11], XLXN_545[12], XLXN_545[13], XLXN_545[14], XLXN_545[15], XLXN_545[16], XLXN_545[17], XLXN_545[18], XLXN_545[19], XLXN_545[20], XLXN_545[21], XLXN_545[22], XLXN_545[23], XLXN_545[24], XLXN_545[25], XLXN_545[26], XLXN_545[27], XLXN_545[28], XLXN_545[29], XLXN_545[30], XLXN_545[31]}),
    .leftKeyOut({XLXN_550[0], XLXN_550[1], XLXN_550[2], XLXN_550[3], XLXN_550[4], XLXN_550[5], XLXN_550[6], XLXN_550[7], XLXN_550[8], XLXN_550[9], XLXN_550[10], XLXN_550[11], XLXN_550[12], XLXN_550[13], XLXN_550[14], XLXN_550[15], XLXN_550[16], XLXN_550[17], XLXN_550[18], XLXN_550[19], XLXN_550[20], XLXN_550[21], XLXN_550[22], XLXN_550[23], XLXN_550[24], XLXN_550[25], XLXN_550[26], XLXN_550[27]}),
    .rightKeyOut({XLXN_549[0], XLXN_549[1], XLXN_549[2], XLXN_549[3], XLXN_549[4], XLXN_549[5], XLXN_549[6], XLXN_549[7], XLXN_549[8], XLXN_549[9], XLXN_549[10], XLXN_549[11], XLXN_549[12], XLXN_549[13], XLXN_549[14], XLXN_549[15], XLXN_549[16], XLXN_549[17], XLXN_549[18], XLXN_549[19], XLXN_549[20], XLXN_549[21], XLXN_549[22], XLXN_549[23], XLXN_549[24], XLXN_549[25], XLXN_549[26], XLXN_549[27]}),
    .rightOut({XLXN_618[0], XLXN_618[1], XLXN_618[2], XLXN_618[3], XLXN_618[4], XLXN_618[5], XLXN_618[6], XLXN_618[7], XLXN_618[8], XLXN_618[9], XLXN_618[10], XLXN_618[11], XLXN_618[12], XLXN_618[13], XLXN_618[14], XLXN_618[15], XLXN_618[16], XLXN_618[17], XLXN_618[18], XLXN_618[19], XLXN_618[20], XLXN_618[21], XLXN_618[22], XLXN_618[23], XLXN_618[24], XLXN_618[25], XLXN_618[26], XLXN_618[27], XLXN_618[28], XLXN_618[29], XLXN_618[30], XLXN_618[31]}));
  roundRot1 XLXI_203 (
    .leftIn({XLXN_545[0], XLXN_545[1], XLXN_545[2], XLXN_545[3], XLXN_545[4], XLXN_545[5], XLXN_545[6], XLXN_545[7], XLXN_545[8], XLXN_545[9], XLXN_545[10], XLXN_545[11], XLXN_545[12], XLXN_545[13], XLXN_545[14], XLXN_545[15], XLXN_545[16], XLXN_545[17], XLXN_545[18], XLXN_545[19], XLXN_545[20], XLXN_545[21], XLXN_545[22], XLXN_545[23], XLXN_545[24], XLXN_545[25], XLXN_545[26], XLXN_545[27], XLXN_545[28], XLXN_545[29], XLXN_545[30], XLXN_545[31]}),
    .rightKeyIn({XLXN_549[0], XLXN_549[1], XLXN_549[2], XLXN_549[3], XLXN_549[4], XLXN_549[5], XLXN_549[6], XLXN_549[7], XLXN_549[8], XLXN_549[9], XLXN_549[10], XLXN_549[11], XLXN_549[12], XLXN_549[13], XLXN_549[14], XLXN_549[15], XLXN_549[16], XLXN_549[17], XLXN_549[18], XLXN_549[19], XLXN_549[20], XLXN_549[21], XLXN_549[22], XLXN_549[23], XLXN_549[24], XLXN_549[25], XLXN_549[26], XLXN_549[27]}),
    .leftKeyIn({XLXN_550[0], XLXN_550[1], XLXN_550[2], XLXN_550[3], XLXN_550[4], XLXN_550[5], XLXN_550[6], XLXN_550[7], XLXN_550[8], XLXN_550[9], XLXN_550[10], XLXN_550[11], XLXN_550[12], XLXN_550[13], XLXN_550[14], XLXN_550[15], XLXN_550[16], XLXN_550[17], XLXN_550[18], XLXN_550[19], XLXN_550[20], XLXN_550[21], XLXN_550[22], XLXN_550[23], XLXN_550[24], XLXN_550[25], XLXN_550[26], XLXN_550[27]}),
    .rightIn({XLXN_618[0], XLXN_618[1], XLXN_618[2], XLXN_618[3], XLXN_618[4], XLXN_618[5], XLXN_618[6], XLXN_618[7], XLXN_618[8], XLXN_618[9], XLXN_618[10], XLXN_618[11], XLXN_618[12], XLXN_618[13], XLXN_618[14], XLXN_618[15], XLXN_618[16], XLXN_618[17], XLXN_618[18], XLXN_618[19], XLXN_618[20], XLXN_618[21], XLXN_618[22], XLXN_618[23], XLXN_618[24], XLXN_618[25], XLXN_618[26], XLXN_618[27], XLXN_618[28], XLXN_618[29], XLXN_618[30], XLXN_618[31]}),
    .rightOut({XLXN_617[0], XLXN_617[1], XLXN_617[2], XLXN_617[3], XLXN_617[4], XLXN_617[5], XLXN_617[6], XLXN_617[7], XLXN_617[8], XLXN_617[9], XLXN_617[10], XLXN_617[11], XLXN_617[12], XLXN_617[13], XLXN_617[14], XLXN_617[15], XLXN_617[16], XLXN_617[17], XLXN_617[18], XLXN_617[19], XLXN_617[20], XLXN_617[21], XLXN_617[22], XLXN_617[23], XLXN_617[24], XLXN_617[25], XLXN_617[26], XLXN_617[27], XLXN_617[28], XLXN_617[29], XLXN_617[30], XLXN_617[31]}));  // open: rightKeyOut, leftKeyOut
  revPerm XLXI_10 (
    .leftinput({XLXN_617[0], XLXN_617[1], XLXN_617[2], XLXN_617[3], XLXN_617[4], XLXN_617[5], XLXN_617[6], XLXN_617[7], XLXN_617[8], XLXN_617[9], XLXN_617[10], XLXN_617[11], XLXN_617[12], XLXN_617[13], XLXN_617[14], XLXN_617[15], XLXN_617[16], XLXN_617[17], XLXN_617[18], XLXN_617[19], XLXN_617[20], XLXN_617[21], XLXN_617[22], XLXN_617[23], XLXN_617[24], XLXN_617[25], XLXN_617[26], XLXN_617[27], XLXN_617[28], XLXN_617[29], XLXN_617[30], XLXN_617[31]}),
    .rightinput({XLXN_618[0], XLXN_618[1], XLXN_618[2], XLXN_618[3], XLXN_618[4], XLXN_618[5], XLXN_618[6], XLXN_618[7], XLXN_618[8], XLXN_618[9], XLXN_618[10], XLXN_618[11], XLXN_618[12], XLXN_618[13], XLXN_618[14], XLXN_618[15], XLXN_618[16], XLXN_618[17], XLXN_618[18], XLXN_618[19], XLXN_618[20], XLXN_618[21], XLXN_618[22], XLXN_618[23], XLXN_618[24], XLXN_618[25], XLXN_618[26], XLXN_618[27], XLXN_618[28], XLXN_618[29], XLXN_618[30], XLXN_618[31]}),
    .myoutput({XLXN_616[0], XLXN_616[1], XLXN_616[2], XLXN_616[3], XLXN_616[4], XLXN_616[5], XLXN_616[6], XLXN_616[7], XLXN_616[8], XLXN_616[9], XLXN_616[10], XLXN_616[11], XLXN_616[12], XLXN_616[13], XLXN_616[14], XLXN_616[15], XLXN_616[16], XLXN_616[17], XLXN_616[18], XLXN_616[19], XLXN_616[20], XLXN_616[21], XLXN_616[22], XLXN_616[23], XLXN_616[24], XLXN_616[25], XLXN_616[26], XLXN_616[27], XLXN_616[28], XLXN_616[29], XLXN_616[30], XLXN_616[31], XLXN_616[32], XLXN_616[33], XLXN_616[34], XLXN_616[35], XLXN_616[36], XLXN_616[37], XLXN_616[38], XLXN_616[39], XLXN_616[40], XLXN_616[41], XLXN_616[42], XLXN_616[43], XLXN_616[44], XLXN_616[45], XLXN_616[46], XLXN_616[47], XLXN_616[48], XLXN_616[49], XLXN_616[50], XLXN_616[51], XLXN_616[52], XLXN_616[53], XLXN_616[54], XLXN_616[55], XLXN_616[56], XLXN_616[57], XLXN_616[58], XLXN_616[59], XLXN_616[60], XLXN_616[61], XLXN_616[62], XLXN_616[63]}));
